# EAGLE schematic PiDog (EAGLE 6.1)
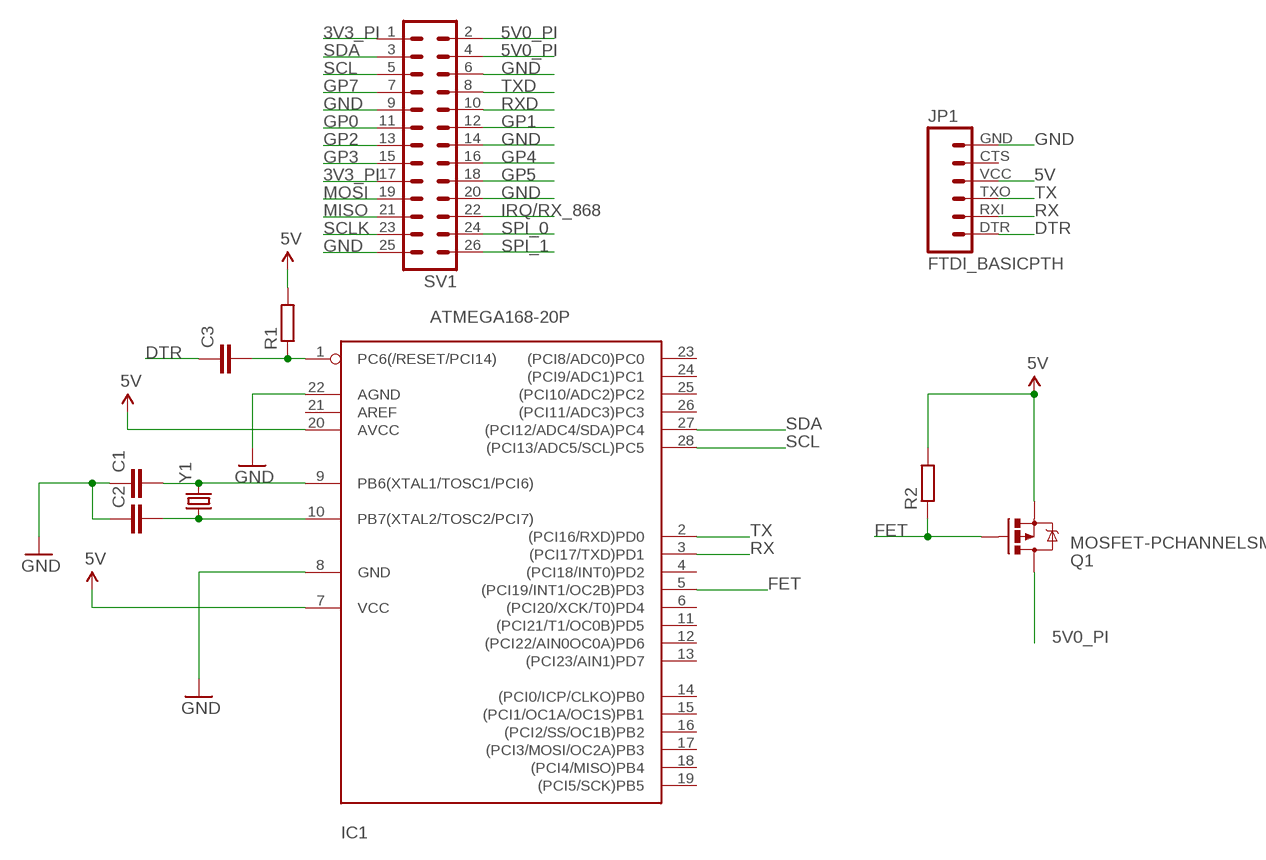
[diagram p0: schematic, sheet 1]

## Parts
C1  C-EU025-030X050  [C025-030X050]
C2  C-EU025-030X050  [C025-030X050]
C3  C-EU025-030X050  [C025-030X050]
IC1  ATMEGA168-20P  [DIL28-3]
JP1  FTDI_BASICPTH  [FTDI_BASIC]
Q1  MOSFET-PCHANNELSMD  [SOT23-3]
R1  R-EU_0603K-SMALL  [C0603K-SMALL]
R2  R-EU_0603K-SMALL  [C0603K-SMALL]
SV1  MA13-2-NO-SILK  [MA13-2-NS]
Y1  CRYSTALHC49US  [HC49US]

## Nets
3V3_PI [3V3_PI]: SV1.1 SV1.17
5V: IC1.7(VCC) IC1.20(AVCC) JP1.VCC Q1.2(S) R1.2 R2.2
5V0_PI [5V0_PI]: Q1.3(D) SV1.2 SV1.4
DTR: C3.1 JP1.DTR
FET: IC1.5((PCI19/INT1/OC2B)PD3) Q1.1(G) R2.1
GND: C1.1 C2.1 IC1.8(GND) IC1.22(AGND) JP1.GND SV1.6 SV1.9 SV1.14 SV1.20 SV1.25
GP0: SV1.11
GP1: SV1.12
GP2: SV1.13
GP3: SV1.15
GP4: SV1.16
GP5: SV1.18
GP7: SV1.7
IRQ/RX_868: SV1.22
MISO: SV1.21
MOSI: SV1.19
N$2: C1.2 IC1.9(PB6(XTAL1/TOSC1/PCI6)) Y1.2
N$4: C2.2 IC1.10(PB7(XTAL2/TOSC2/PCI7)) Y1.1
RESET: C3.2 IC1.1(PC6(/RESET/PCI14)) R1.1
RX: IC1.3((PCI17/TXD)PD1) JP1.RXI
RXD: SV1.10
SCL: IC1.28((PCI13/ADC5/SCL)PC5) SV1.5
SCLK: SV1.23
SDA: IC1.27((PCI12/ADC4/SDA)PC4) SV1.3
SPI_0: SV1.24
SPI_1: SV1.26
TX: IC1.2((PCI16/RXD)PD0) JP1.TXO
TXD: SV1.8
Unconnected: IC1.4((PCI18/INT0)PD2) IC1.6((PCI20/XCK/T0)PD4) IC1.11((PCI21/T1/OC0B)PD5) IC1.12((PCI22/AIN0OC0A)PD6) IC1.13((PCI23/AIN1)PD7) IC1.14((PCI0/ICP/CLKO)PB0) IC1.15((PCI1/OC1A/OC1S)PB1) IC1.16((PCI2/SS/OC1B)PB2) IC1.17((PCI3/MOSI/OC2A)PB3) IC1.18((PCI4/MISO)PB4) IC1.19((PCI5/SCK)PB5) IC1.21(AREF) IC1.23((PCI8/ADC0)PC0) IC1.24((PCI9/ADC1)PC1) IC1.25((PCI10/ADC2)PC2) IC1.26((PCI11/ADC3)PC3) JP1.CTS

## Library data of the parts
C1-C3 = CISECO eaglecad designs:C-EU: CAPACITOR, European symbol
IC1 = adafruit:ATMEGA168*P: MICROCONTROLLER 16 kBytes FLASH 1 kBytes SRAM 512 Bytes EEPROM USART 8-channel 10 bit ADC
JP1 = SparkFunJan12:FTDI_BASIC: FTDI Basic: 3.3V and 5V
Q1 = SparkFunJan12:MOSFET-PCHANNEL
R1 R2 = CISECO eaglecad designs:R-EU_: RESISTOR, European symbol
SV1 = CISECO eaglecad designs:MA13-2: PIN HEADER
Y1 = CISECO eaglecad designs:CRYSTAL: Crystals Various standard crystals. Proven footprints. Spark Fun Electronics SKU : COM-00534

## Net classes
0 default: width 0.15 mm, drill 0.3 mm
3 5V0_PI: width 0.406 mm, drill 0.4 mm
4 3V3_PI: width 0.254 mm, drill 0.4 mm